# Altium schematic sheet Sheet1.SchDoc
size 381 x 381 mm
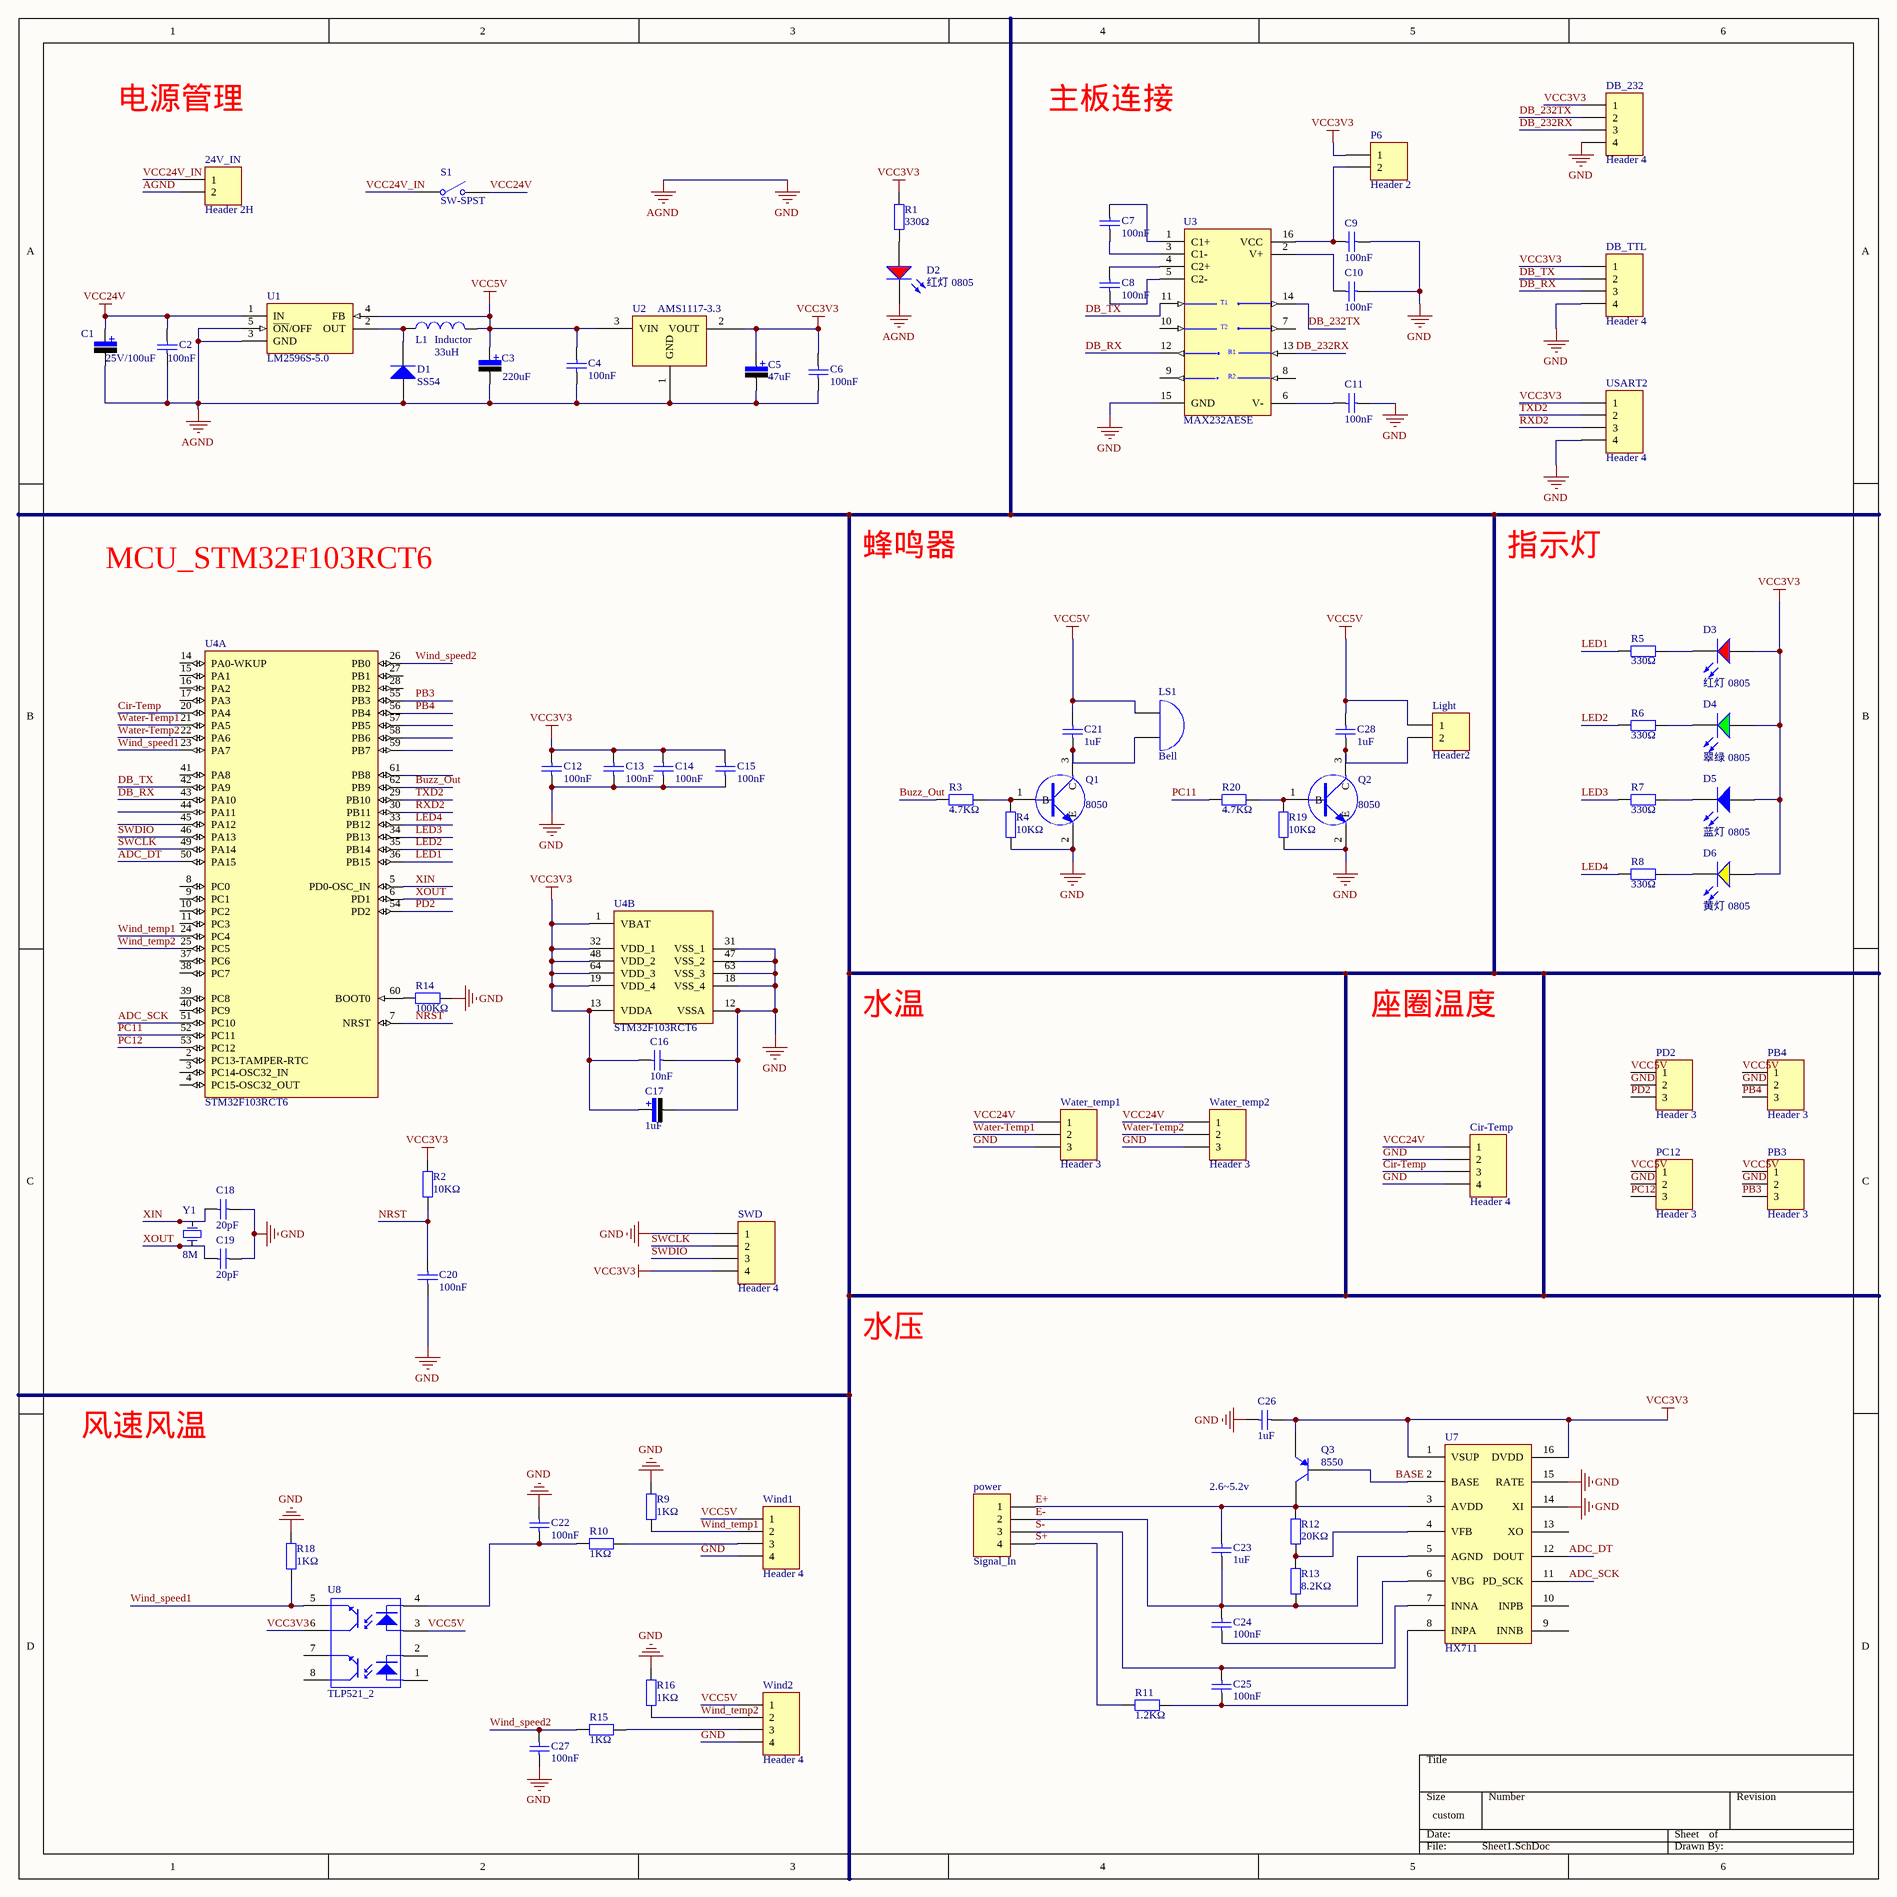
[diagram p0: Sheet1.SchDoc]

## Parts
24V_IN  Header 2H  [4.2mm接插件2P]
C1  value 25V/100uF  [CC6.56.5]  (hidden comment: Cap Pol)
C2  100nF  [0805_C]
C3  value 220uF  [CC6.56.5]  (hidden comment: Cap Pol)
C4  100nF  [0805_C]
C5  value 47uF  [贴片电容5*5.4]  (hidden comment: Cap Pol)
C6  100nF  [0805_C]
C7  100nF  [0805_C]
C8  100nF  [0805_C]
C9  100nF  [0805_C]
C10  100nF  [0805_C]
C11  100nF  [0805_C]
C12  100nF  [0805_C]
C13  100nF  [0805_C]
C14  100nF  [0805_C]
C15  100nF  [0805_C]
C16  10nF  [0805_C]
C17  value 1uF  [贴片电容5*5.4]  (hidden comment: Cap Pol)
C18  20pF  [0805_C]
C19  20pF  [0805_C]
C20  100nF  [0805_C]
C21  1uF  [0805_C]
C22  100nF  [0805_C]
C23  1uF  [0805_C]
C24  100nF  [0805_C]
C25  100nF  [0805_C]
C26  1uF  [0805_C]
C27  100nF  [0805_C]
C28  1uF  [0805_C]
Cir-Temp  Header 4  [3.81MM-4P]
D1  SS54  [SMA(DO-214AC)_S1]
D2  红灯 0805  [0805_LED_S1]
D3  红灯 0805  [0805_LED_S1]
D4  翠绿 0805  [0805_LED_S1]
D5  蓝灯 0805  [0805_LED_S1]
D6  黄灯 0805  [0805_LED_S1]
DB_232  Header 4  [3.81MM-4P]
DB_TTL  Header 4  [3.81MM-4P]
L1  Inductor  value 33uH  [功率电感7*7]
Light  Header2  [3.81mm-2P]
LS1  Bell  [有源蜂鸣器5V]
P6  Header 2  [HDR1X2]
PB3  Header 3  [HDR1X3]
PB4  Header 3  [HDR1X3]
PC12  Header 3  [HDR1X3]
PD2  Header 3  [HDR1X3]
power  Signal_In  [3.81MM-4P]
Q1  8050  [SOT-23_3C]
Q2  8050  [SOT-23_3C]
Q3  8550  [SOT23A]
R1  330Ω  [0805_R]
R2  10KΩ  [0805_R]
R3  4.7KΩ  [0805_R]
R4  10KΩ  [0805_R]
R5  330Ω  [0805_R]
R6  330Ω  [0805_R]
R7  330Ω  [0805_R]
R8  330Ω  [0805_R]
R9  1KΩ  [0805_R]
R10  1KΩ  [0805_R]
R11  1.2KΩ  [0805_R]
R12  20KΩ  [0805_R]
R13  8.2KΩ  [0805_R]
R14  100KΩ  [0805_R]
R15  1KΩ  [0805_R]
R16  1KΩ  [0805_R]
R18  1KΩ  [0805_R]
R19  10KΩ  [0805_R]
R20  4.7KΩ  [0805_R]
S1  SW-SPST  [纽子开关]
SWD  Header 4  [HDR1X4]
U1  LM2596S-5.0  [TO-263-5L(D2PAK)]
U2  AMS1117-3.3  [SOT223]
U3  MAX232AESE  [L16_L]
U4  STM32F103RCT6  [LQFP-64_10x10x05P]  (parts A,B of 2)
U7  HX711  [HX711_增加引脚长度]
U8  TLP521_2  [TLP521-2]
USART2  Header 4  [3.81MM-4P]
Water_temp1  Header 3  [3.81mm-3P]
Water_temp2  Header 3  [3.81mm-3P]
Wind1  Header 4  [3.81MM-4P]
Wind2  Header 4  [3.81MM-4P]
Y1  value 8M  [X-HC49U]  (hidden comment: XTAL)

## Nets
AGND: 24V_IN.2 C1.2 C2.1 C3.2 C4.1 C5.2 C6.1 C9.1 C10.1 C11.1 C12.1 C13.1 C14.1 C15.1 C16.2 C17.2 C18.2 C19.2 C20.1 C22.1 C26.2 C27.1 Cir-Temp.2 Cir-Temp.4 D1.1(A) D2.K DB_232.4 DB_TTL.4 PB3.2 PB4.2 PC12.2 PD2.2 Q1.2(E) Q2.2(E) R4.1 R9.2 R14.2 R16.2 R18.2 R19.1 SWD.1 U1.3(GND) U1.5(~{ON}/OFF) U2.1(GND) U3.15(GND) U4.12(VSSA) U4.18(VSS_4) U4.31(VSS_1) U4.47(VSS_2) U4.63(VSS_3) U7.14(XI) U7.15(RATE) USART2.4 Water_temp1.3 Water_temp2.3 Wind1.4 Wind2.4  [also labelled GND]
VCC3V3: C5.1 C6.2 C12.2 C13.2 C14.2 C15.2 C16.1 C17.1 C26.1 D3.A D4.A D5.A D6.A DB_232.1 DB_TTL.1 P6.1 Q3.2(E) R1.2 R2.2 SWD.4 U2.2(VOUT) U4.1(VBAT) U4.13(VDDA) U4.19(VDD_4) U4.32(VDD_1) U4.48(VDD_2) U4.64(VDD_3) U7.1(VSUP) U7.16(DVDD) U8.6(C) USART2.1
VCC5V: C3.1 C4.2 C21.2 C28.2 L1.2 Light.1 LS1.1(A) PB3.1 PB4.1 PC12.1 PD2.1 U1.4(FB) U2.3(VIN) U8.3(A) Wind1.1 Wind2.1
VCC24V: C1.1 C2.2 Cir-Temp.1 S1.2(NO) U1.1(IN) Water_temp1.1 Water_temp2.1
ADC_DT: U4.50(PA15) U7.12(DOUT)
ADC_SCK: U4.51(PC10) U7.11(PD_SCK)
BASE: Q3.1(B) U7.2(BASE)
Buzz_Out: R3.1 U4.62(PB9)
Cir-Temp: Cir-Temp.3 U4.20(PA4)
DB_232RX: DB_232.3 U3.13(R1IN)
DB_232TX: DB_232.2 U3.14(T1OUT)
DB_RX: DB_TTL.3 U3.12(R1OUT) U4.43(PA10)
DB_TX: DB_TTL.2 U3.11(T1IN) U4.42(PA9)
E+: C23.2 power.1 Q3.3(C) R12.2 U7.3(AVDD)
E-: C23.1 C24.2 power.2 R13.1 U7.5(AGND)
LED1: R5.1 U4.36(PB15)
LED2: R6.1 U4.35(PB14)
LED3: R7.1 U4.34(PB13)
LED4: R8.1 U4.33(PB12)
NRST: C20.2 R2.1 U4.7(NRST)
PB3: PB3.3 U4.55(PB3)
PB4: PB4.3 U4.56(PB4)
PC11: R20.1 U4.52(PC11)
PC12: PC12.3 U4.53(PC12)
PD2: PD2.3 U4.54(PD2)
RXD2: U4.30(PB11) USART2.3
S+: power.4 R11.1
S-: C25.2 power.3 U7.7(INNA)
SWCLK: SWD.2 U4.49(PA14)
SWDIO: SWD.3 U4.46(PA13)
TXD2: U4.29(PB10) USART2.2
VCC24V_IN: 24V_IN.1 S1.1(COMMON)
Water-Temp1: U4.21(PA5) Water_temp1.2
Water-Temp2: U4.22(PA6) Water_temp2.2
Wind_speed1: R18.1 U4.23(PA7) U8.5(E)
Wind_speed2: C27.2 R15.1 U4.26(PB0)
Wind_temp1: R9.1 U4.24(PC4) Wind1.2
Wind_temp2: R16.1 U4.25(PC5) Wind2.2
XIN: C18.1 U4.5(PD0-OSC_IN) Y1.1(OSC1)
XOUT: C19.1 U4.6(PD1) Y1.2(OSC2)
NetC7_1: C7.1 U3.3(C1-)
NetC7_2: C7.2 U3.1(C1+)
NetC8_1: C8.1 U3.5(C2-)
NetC8_2: C8.2 U3.4(C2+)
NetC9_2: C9.2 P6.2 U3.16(VCC)
NetC10_2: C10.2 U3.2(V+)
NetC11_2: C11.2 U3.6(V-)
NetC21_1: C21.1 LS1.2(B) Q1.3(C)
NetC22_2: C22.2 R10.1 U8.4(K)
NetC24_1: C24.1 U7.6(VBG)
NetC25_1: C25.1 R11.2 U7.8(INPA)
NetC28_1: C28.1 Light.2 Q2.3(C)
NetD1_2: D1.2(K) L1.1 U1.2(OUT)
NetD2_A: D2.A R1.1
NetD3_K: D3.K R5.2
NetD4_K: D4.K R6.2
NetD5_K: D5.K R7.2
NetD6_K: D6.K R8.2
NetQ1_1: Q1.1(B) R3.2 R4.2
NetQ2_1: Q2.1(B) R19.2 R20.2
NetR10_2: R10.2 Wind1.3
NetR12_1: R12.1 R13.2 U7.4(VFB)
NetR14_1: R14.1 U4.60(BOOT0)
NetR15_2: R15.2 Wind2.3

Not connected (* = marked no-connect by the designer): U3 7(T2OUT) 8(R2IN) 9(R2OUT) 10(T2IN); U4 2(PC13-TAMPER-RTC) 3(PC14-OSC32_IN) 4(PC15-OSC32_OUT) 8(PC0) 9(PC1) 10(PC2) 11(PC3) 14(PA0-WKUP) 15(PA1) 16(PA2) 17(PA3) 27(PB1) 28(PB2) 37(PC6) 38(PC7) 39(PC8) 40(PC9) 41(PA8) 44(PA11) 45(PA12) 57(PB5) 58(PB6) 59(PB7) 61(PB8); U7 9(INNB) 10(INPB) 13(XO); U8 1(A) 2(K) 7(E) 8(C)

## Notes on the sheet
- 电源管理
- 主板连接
- MCU_STM32F103RCT6
- 蜂鸣器
- 指示灯
- 水温
- 座圈温度
- 水压
- 风速风温
- 2.6~5.2v
- (in symbol MAX232AESE) T1; T2; R1; R2

## Library data of the parts
24V_IN = Header 2H: Header, 2-Pin, Right Angle; LatestRevisionDate: 17-Jul-2002; LatestRevisionNote: Re-released for DXP Platform.; Publisher: Altium Limited
C1 C3 C5 C17 = Cap Pol: 极性电解电容; Vol: 16V; Published: 8-Jun-2000; LatestRevisionDate: 17-Jul-2002; LatestRevisionNote: Re-released for DXP Platform.; PackageReference: RB7.6-15; Publisher: Altium Limited
C2 C4 C6-C15 C20 C22 C24 C25 C27 = 0805 100nF(104) 10% 50V: 贴片电容; ComponentLink1Description: 供应商链接; ComponentLink1URL: http://www.szlcsc.com/product/details_50686.html; Package: 0805; Supplier: LC; SuppliersPartNumber: C49678
C16 = 0805 10nF (103) 10% 50V: 贴片电容; ComponentLink1Description: 供应商链接; ComponentLink1URL: http://www.szlcsc.com/product/details_2062.html; Package: 0805; Supplier: LC; SuppliersPartNumber: C1710
C18 C19 = 0805 20pF (200) 5% 50V: 贴片电容; ComponentLink1Description: 供应商链接; ComponentLink1URL: http://www.szlcsc.com/product/details_2150.html; Package: 0805; Supplier: LC; SuppliersPartNumber: C1798
C21 C23 C26 C28 = 0805 1uF (105) 10% 50V: 贴片电容; ComponentLink1Description: 供应商链接; ComponentLink1URL: http://www.szlcsc.com/product/details_29074.html; Package: 0805; Supplier: LC; SuppliersPartNumber: C28323
Cir-Temp DB_232 DB_TTL power SWD USART2 Wind1 Wind2 = Header 4: Header, 4-Pin; LatestRevisionDate: 17-Jul-2002; LatestRevisionNote: Re-released for DXP Platform.; Publisher: Altium Limited
D1 = SMA(DO-214AC) SS54: 二极管; ComponentLink1Description: 供应商链接; ComponentLink1URL: http://www.szlcsc.com/product/details_23178.html; Package: SMA(DO-214AC); Supplier: LC; SuppliersPartNumber: C22452
D2 D3 = 0805 红灯: 发光二极管; ComponentLink1Description: 供应商链接; ComponentLink1URL: http://www.szlcsc.com/product/details_2668.html; Package: 0805; Supplier: LC; SuppliersPartNumber: C2295
D4 = 0805 翠绿: 发光二极管; ComponentLink1Description: 供应商链接; ComponentLink1URL: http://www.szlcsc.com/product/details_2670.html; Package: 0805; Supplier: LC; SuppliersPartNumber: C2297
D5 = 0805 蓝灯: 发光二极管; ComponentLink1Description: 供应商链接; ComponentLink1URL: http://www.szlcsc.com/product/details_2666.html; Package: 0805; Supplier: LC; SuppliersPartNumber: C2293
D6 = 0805 黄灯: 发光二极管; ComponentLink1Description: 供应商链接; ComponentLink1URL: http://www.szlcsc.com/product/details_2669.html; Package: 0805; Supplier: LC; SuppliersPartNumber: C2296
L1 = Inductor: Code_IEC: 1005; Published: 8-Jun-2000; LatestRevisionDate: 17-Jul-2002; LatestRevisionNote: Re-released for DXP Platform.; PackageReference: 0402-A; Publisher: Altium Limited; Code_JEITA: 0402
Light P6 = Header 2: Header, 2-Pin; LatestRevisionDate: 17-Jul-2002; LatestRevisionNote: Re-released for DXP Platform.; Publisher: Altium Limited
LS1 = Bell: Electrical Bell; Published: 24-Mar-1999; LatestRevisionDate: 17-Jul-2002; LatestRevisionNote: Re-released for DXP Platform.; PackageReference: PIN2; Publisher: Altium Limited
PB3 PB4 PC12 PD2 Water_temp1 Water_temp2 = Header 3: Header, 3-Pin; LatestRevisionDate: 17-Jul-2002; LatestRevisionNote: Re-released for DXP Platform.; Publisher: Altium Limited
Q1 Q2 = NPN(1)
Q3 = pnp8550
R1 R5-R8 = 0805 330Ω (3300) 1%: 贴片电阻; ComponentLink1Description: 供应商链接; ComponentLink1URL: http://www.szlcsc.com/product/details_18318.html; Package: 0805; Supplier: LC; SuppliersPartNumber: C17630
R2 R4 R19 = 0805 10KΩ (1002) 1%: 贴片电阻; ComponentLink1Description: 供应商链接; ComponentLink1URL: http://www.szlcsc.com/product/details_18102.html; Package: 0805; Supplier: LC; SuppliersPartNumber: C17414
R3 R20 = 0805 4.7KΩ (4701) 1%: 贴片电阻; ComponentLink1Description: 供应商链接; ComponentLink1URL: http://www.szlcsc.com/product/details_18361.html; Package: 0805; Supplier: LC; SuppliersPartNumber: C17673
R9 R10 R15 R16 R18 = 0805 1KΩ (1001) 1%: 贴片电阻; ComponentLink1Description: 供应商链接; ComponentLink1URL: http://www.szlcsc.com/product/details_18201.html; Package: 0805; Supplier: LC; SuppliersPartNumber: C17513
R11 = 0805 1.2KΩ (1201) 1%: 贴片电阻; ComponentLink1Description: 供应商链接; ComponentLink1URL: http://www.szlcsc.com/product/details_18067.html; Package: 0805; Supplier: LC; SuppliersPartNumber: C17379
R12 = 0805 20KΩ (2002) 1%: 贴片电阻; ComponentLink1Description: 供应商链接; ComponentLink1URL: http://www.szlcsc.com/product/details_4735.html; Package: 0805; Supplier: LC; SuppliersPartNumber: C4328
R13 = 0805 8.2KΩ (8201) 1%: 贴片电阻; ComponentLink1Description: 供应商链接; ComponentLink1URL: http://www.szlcsc.com/product/details_18516.html; Package: 0805; Supplier: LC; SuppliersPartNumber: C17828
R14 = 0805 100KΩ (1003) 1%: 贴片电阻; ComponentLink1Description: 供应商链接; ComponentLink1URL: http://www.szlcsc.com/product/details_18095.html; Package: 0805; Supplier: LC; SuppliersPartNumber: C17407
S1 = SW-SPST: Single-Pole, Single-Throw Switch; Published: 24-Mar-1999; LatestRevisionDate: 17-Jul-2002; LatestRevisionNote: Re-released for DXP Platform.; PackageReference: SPST-2; Publisher: Altium Limited
U1 = LM2596S-5.0: Simple Switcher Power Converter 150 kHz 3A Step Down Voltage Regulator; Note: Tab is connected to GND; Published: 15-Apr-2002; DatasheetVersion: Dec-1997; PackageReference: TS5B; Publisher: Altium Limited; PackageDescription: D2-PAK; 5 Leads; Body 14.4 (inc. leads) x 10.4 mm (LxW max); ComponentLink1Description: Manufacturer Link; ComponentLink1URL: http://www.national.com/; ComponentLink2Description: Datasheet; ComponentLink2URL: http://www.national.com/ds.cgi/LM/LM2596.pdf; ComponentLink3Description: URL Link1; ComponentLink3URL: http://www.national.com/pf/LM/LM2596.html
U2 = AS1117
U3 = MAX232AESE: +5V-Powered, Multichannel RS-232 Driver/Receiver; Published: 16-Jan-2001; LatestRevisionDate: 13-Apr-2006; LatestRevisionNote: IPC-7351 Footprint Added.; DatasheetVersion: Nov-1997; PackageReference: NSO16; Publisher: Altium Limited; PackageDescription: 16-Pin Small Outline Integrated Circuit 1.27 mm Pitch; Code_JEDEC: MS-012-AC; Code_IPC: SOIC127P600-16; ComponentLink1Description: Manufacturer Link; ComponentLink1URL: http://www.maxim-ic.com/; ComponentLink2Description: Datasheet; ComponentLink2URL: http://pdfserv.maxim-ic.com/en/ds/MAX220-MAX249.pdf
U4 = STM32F103RCT6: ARM; ComponentLink1Description: 供应商链接; ComponentLink1URL: http://www.szlcsc.com/product/details_8815.html; Package: LQFP-64_10x10x05P; Supplier: LC; SuppliersPartNumber: C8323
U7 = HX711: 24 位 A/D 转 换器芯片，集成稳压电源、片内时钟振荡器等
Y1 = XTAL: 晶振; Published: 8-Jun-2000; LatestRevisionDate: 17-Jul-2002; LatestRevisionNote: Re-released for DXP Platform.; PackageReference: R38; Publisher: Altium Limited